# Altium schematic sheet schemat_furnace.schdoc
size 272 x 175 mm
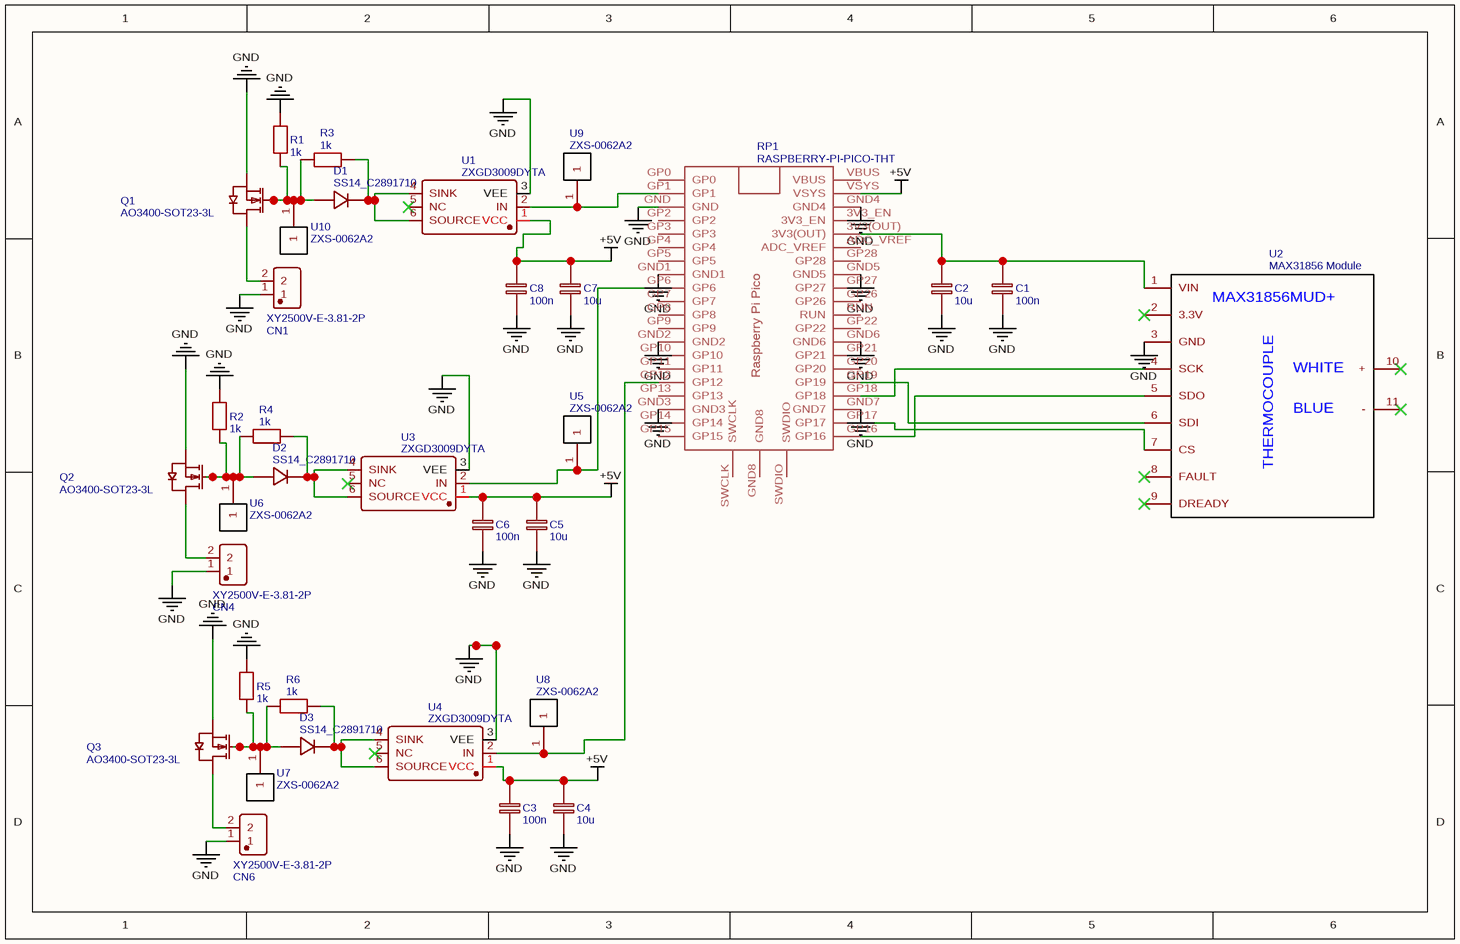
[diagram p0: schemat_furnace.schdoc]

## Parts
C1  100n  [CAP-TH_L3.6-W2.3-P2.5-D0.6]
C2  10u  [CAP-TH_L3.6-W2.3-P2.5-D0.6]
C3  100n  [CAP-TH_L3.6-W2.3-P2.5-D0.6]
C4  10u  [CAP-TH_L3.6-W2.3-P2.5-D0.6]
C5  10u  [CAP-TH_L3.6-W2.3-P2.5-D0.6]
C6  100n  [CAP-TH_L3.6-W2.3-P2.5-D0.6]
C7  10u  [CAP-TH_L3.6-W2.3-P2.5-D0.6]
C8  100n  [CAP-TH_L3.6-W2.3-P2.5-D0.6]
CN1  XY2500V-E-3.81-2P  [CONN-TH_XY2500V-E-3.81-2P]
CN4  XY2500V-E-3.81-2P  [CONN-TH_XY2500V-E-3.81-2P]
CN6  XY2500V-E-3.81-2P  [CONN-TH_XY2500V-E-3.81-2P]
D1  SS14_C2891710  [SMA_L4.3-W2.6-LS5.2-RD]
D2  SS14_C2891710  [SMA_L4.3-W2.6-LS5.2-RD]
D3  SS14_C2891710  [SMA_L4.3-W2.6-LS5.2-RD]
Q1  AO3400-SOT23-3L  [SOT-23-3_L2.9-W1.6-P1.90-LS2.8-BR]
Q2  AO3400-SOT23-3L  [SOT-23-3_L2.9-W1.6-P1.90-LS2.8-BR]
Q3  AO3400-SOT23-3L  [SOT-23-3_L2.9-W1.6-P1.90-LS2.8-BR]
R1  1k  [R_AXIAL-0.3]
R2  1k  [R_AXIAL-0.3]
R3  1k  [R_AXIAL-0.3]
R4  1k  [R_AXIAL-0.3]
R5  1k  [R_AXIAL-0.3]
R6  1k  [R_AXIAL-0.3]
RP1  RASPBERRY-PI-PICO-THT  [RASPBERRY-PI-PICO-THT]
U1  ZXGD3009DYTA  [SOT-363_L2.0-W1.3-P0.65-LS2.1-BL]
U2  MAX31856 Module  [MAX31856MUD+]
U3  ZXGD3009DYTA  [SOT-363_L2.0-W1.3-P0.65-LS2.1-BL]
U4  ZXGD3009DYTA  [SOT-363_L2.0-W1.3-P0.65-LS2.1-BL]
U5  ZXS-0062A2  [TESTPOINT-SMD_ZXS-0062A2]
U6  ZXS-0062A2  [TESTPOINT-SMD_ZXS-0062A2]
U7  ZXS-0062A2  [TESTPOINT-SMD_ZXS-0062A2]
U8  ZXS-0062A2  [TESTPOINT-SMD_ZXS-0062A2]
U9  ZXS-0062A2  [TESTPOINT-SMD_ZXS-0062A2]
U10  ZXS-0062A2  [TESTPOINT-SMD_ZXS-0062A2]

## Nets
+5V: C3.2 C4.2 C5.2 C6.2 C7.2 C8.2 RP1.VSYS U1.1(VCC) U3.1(VCC) U4.1(VCC)
GND: C1.1 C2.1 C3.1 C4.1 C5.1 C6.1 C7.1 C8.1 CN1.1 CN4.1 CN6.1 Q1.2(S) Q2.2(S) Q3.2(S) R1.2 R2.2 R5.2 RP1.GND RP1.GND1 RP1.GND2 RP1.GND3 RP1.GND4 RP1.GND5 RP1.GND6 RP1.GND7 U1.3(VEE) U2.3(GND) U3.3(VEE) U4.3(VEE)
NetC1_2: C1.2 C2.2 RP1.3V3(OUT) U2.1(VIN)
NetCN1_2: CN1.2 Q1.3(D)
NetCN4_2: CN4.2 Q2.3(D)
NetCN6_2: CN6.2 Q3.3(D)
NetD1_1: D1.1(C) R3.2 U1.4(SINK) U1.6(SOURCE)
NetD1_2: D1.2(A) Q1.1(G) R1.1 R3.1 U10.1
NetD2_1: D2.1(C) R4.2 U3.4(SINK) U3.6(SOURCE)
NetD2_2: D2.2(A) Q2.1(G) R2.1 R4.1 U6.1
NetD3_1: D3.1(C) R6.2 U4.4(SINK) U4.6(SOURCE)
NetD3_2: D3.2(A) Q3.1(G) R5.1 R6.1 U7.1
NetRP1_GP1: RP1.GP1 U1.2(IN) U9.1
NetRP1_GP6: RP1.GP6 U3.2(IN) U5.1
NetRP1_GP12: RP1.GP12 U4.2(IN) U8.1
NetRP1_GP16: RP1.GP16 U2.5(SDO)
NetRP1_GP17: RP1.GP17 U2.7(CS)
NetRP1_GP18: RP1.GP18 U2.4(SCK)
NetRP1_GP19: RP1.GP19 U2.6(SDI)

Not connected (* = marked no-connect by the designer): RP1 3V3_EN ADC_VREF GND8 GP0 GP2 GP3 GP4 GP5 GP7 GP8 GP9 GP10 GP11 GP13 GP14 GP15 GP20 GP21 GP22 GP26 GP27 GP28 RUN SWCLK SWDIO VBUS; U1 5(NC)*; U2 2(3.3V)* 8(FAULT)* 9(DREADY)* 10(+)* 11(-)*; U3 5(NC)*; U4 5(NC)*

## Notes on the sheet
- (in symbol MAX31856 Module) MAX31856MUD+; WHITE; BLUE; THERMOCOUPLE
- (in symbol RASPBERRY-PI-PICO-THT) Raspberry Pi Pico

## Library data of the parts
C1 C3 C6 C8 = 100n: nameAlias: Value(F); Contributor: LCEDA_Lib; spicePre: C; spiceSymbolName: C_0603_EU
C2 C4 C5 C7 = 10u: nameAlias: Value(F); Contributor: LCEDA_Lib; spicePre: C; spiceSymbolName: C_0603_EU
CN1 CN4 CN6 = XY2500V-E-3.81-2P: Manufacturer: XINLAIYA(新莱亚); Contributor: LCSC; Supplier: LCSC; Supplier Part: C880563; Manufacturer Part: XY2500V-E-3.81-2P; JLCPCB Part Class: Extended Part; spicePre: C; spiceSymbolName: XY2500V-E-3.81-2P
D1-D3 = SS14_C2891710: Manufacturer: KUU; Manufacturer Part: SS14; Contributor: LCSC; Supplier: LCSC; Supplier Part: C2891710; spicePre: D; spiceSymbolName: SS14_C2891710
Q1-Q3 = AO3400-SOT23-3L: Manufacturer: PUOLOP(迪浦); Contributor: LCSC; Supplier: LCSC; Supplier Part: C332102; Manufacturer Part: AO3400-SOT23-3L; JLCPCB Part Class: Extended Part; spicePre: Q; spiceSymbolName: AO3400-SOT23-3L
R1-R6 = 1k: nameAlias: Value(Ω); Contributor: LCEDA_Lib; spicePre: R; spiceSymbolName: R_AXIAL-0.3_EU
RP1 = RASPBERRY-PI-PICO-THT: Manufacturer: Raspberry Pi; Manufacturer Part: SC0915; Contributor: trikerdk; Supplier: Elextra; Supplier Part: H51227; link: https://www.elextra.dk/p/raspberry-pi-pico/H51227; spicePre: R; spiceSymbolName: RASPBERRY-PI-PICO-THT
U1 U3 U4 = ZXGD3009DYTA: Manufacturer: DIODES(美台); Contributor: LCSC; Supplier: LCSC; Supplier Part: C441818; Manufacturer Part: ZXGD3009DYTA; JLCPCB Part Class: Extended Part; spicePre: U; spiceSymbolName: ZXGD3009DYTA
U2 = MAX31856 Module: Manufacturer Part: Rohan; Contributor: rohan joshi; spicePre: U; spiceSymbolName: MAX31856 Module
U5-U10 = ZXS-0062A2: Manufacturer: null; Contributor: LCSC; Supplier: LCSC; Supplier Part: C9900001889; Manufacturer Part: ZXS-0062A2; JLCPCB Part Class: Extended Part; spicePre: U; spiceSymbolName: ZXS-0062A2